# EAGLE design m219-bluetooth-input (EAGLE 7.6.0)
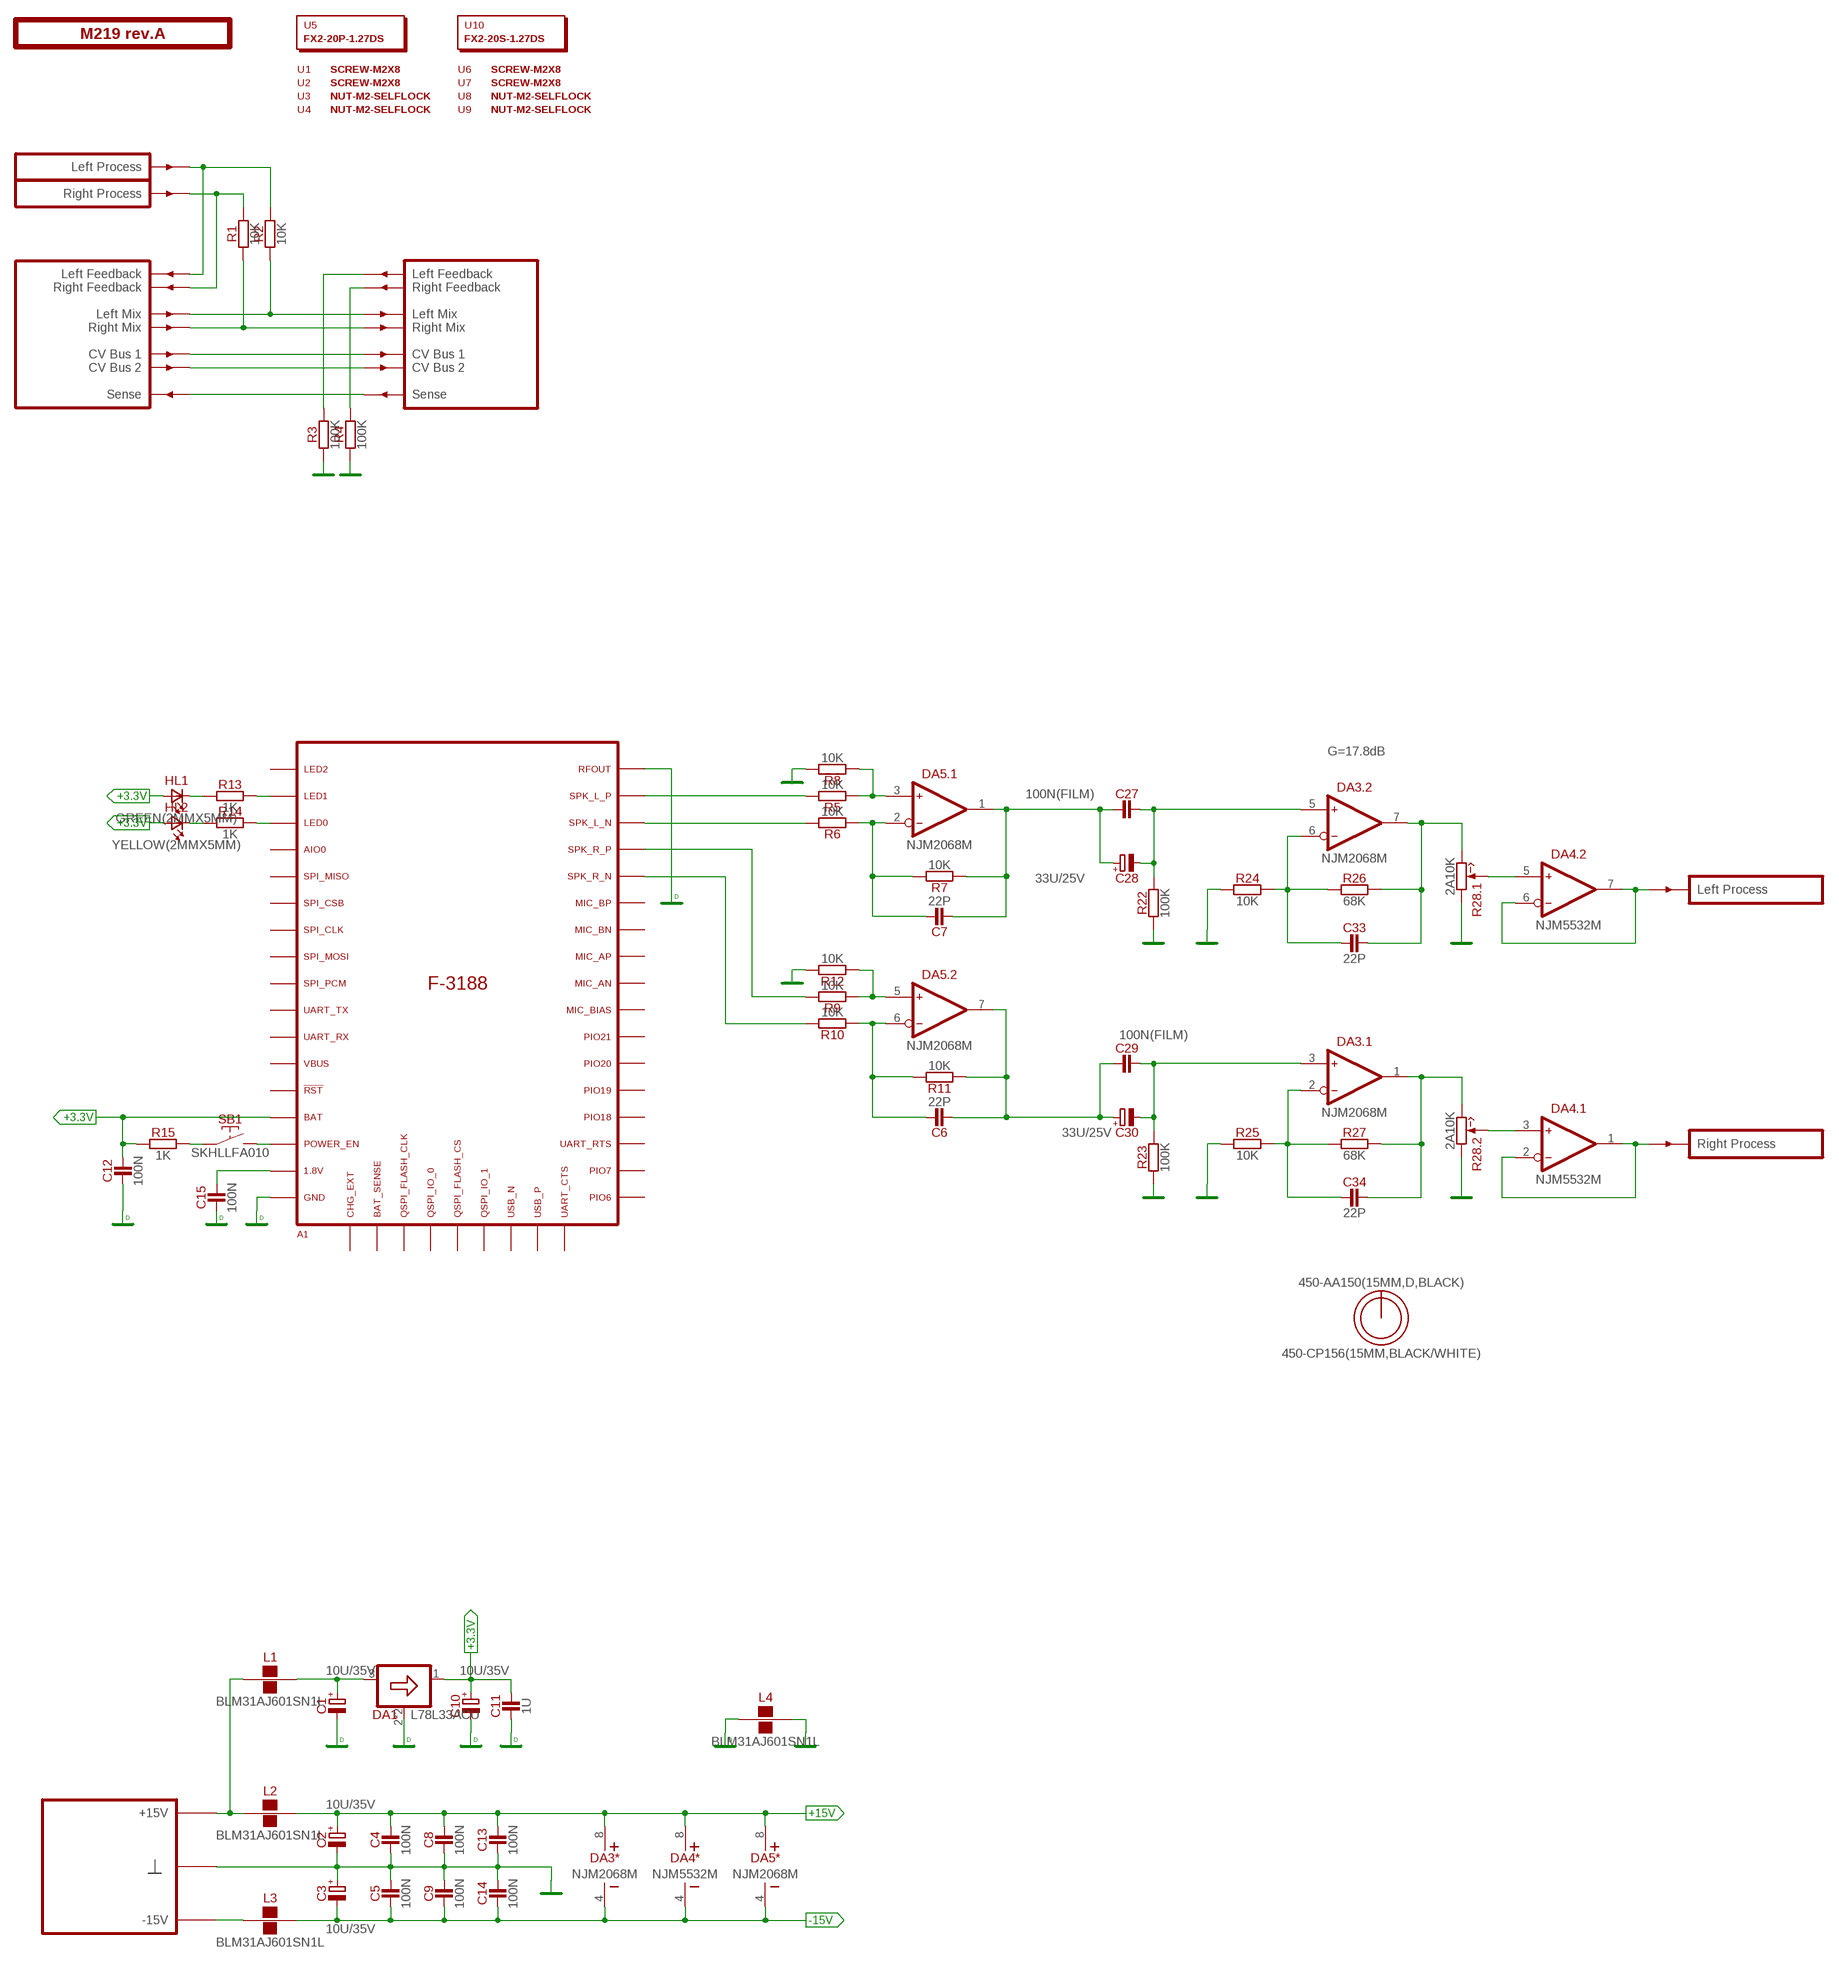
[diagram p0: schematic, sheet 1]

## Parts
A1  F3188  [F3188]
C1  10U/35V  [E2-5]
C2  10U/35V  [E2-5]
C3  10U/35V  [E2-5]
C4  100N  [C-0805]
C5  100N  [C-0805]
C6  22P  [C-0805]
C7  22P  [C-0805]
C8  100N  [C-0805]
C9  100N  [C-0805]
C10  10U/35V  [E2-5]
C11  1U  [C-0805]
C12  100N  [C-0805]
C13  100N  [C-0805]
C14  100N  [C-0805]
C15  100N  [C-0805]
C27  100N(FILM)  [C050-025X075]
C28  33U/25V  [E2,5-7]
C29  100N(FILM)  [C050-025X075]
C30  33U/25V  [E2,5-7]
C33  22P  [C-0805]
C34  22P  [C-0805]
DA1  L78L33ACU  [SOT89]
DA3  NJM2068M  [SO-8]
DA4  NJM5532M  [SO-8]
DA5  NJM2068M  [SO-8]
HL1  GREEN(2MMX5MM)  [LED2X5]
HL2  YELLOW(2MMX5MM)  [LED2X5]
L1  BLM31AJ601SN1L  [1206]
L2  BLM31AJ601SN1L  [1206]
L3  BLM31AJ601SN1L  [1206]
L4  BLM31AJ601SN1L  [1206]
O1  450-AA150(15MM,D,BLACK)  [EMPTY]
O2  450-CP156(15MM,BLACK/WHITE)  [EMPTY]
PCB1  M219 rev.A  ST2-BOARD-50  [ST2-BOARD-50]
R1  10K  [R-0805]
R2  10K  [R-0805]
R3  100K  [R-0805]
R4  100K  [R-0805]
R5  10K  [R-0805]
R6  10K  [R-0805]
R7  10K  [R-0805]
R8  10K  [R-0805]
R9  10K  [R-0805]
R10  10K  [R-0805]
R11  10K  [R-0805]
R12  10K  [R-0805]
R13  1K  [R-0805]
R14  1K  [R-0805]
R15  1K  [R-0805]
R22  100K  [R-0805]
R23  100K  [R-0805]
R24  10K  [R-0805]
R25  10K  [R-0805]
R26  68K  [R-0805]
R27  68K  [R-0805]
R28  2A10K  [RV11-DUAL]
SB1  SKHLLFA010  [SKHLLFA010]
U1  SCREW-M2X8  [EMPTY]
U2  SCREW-M2X8  [EMPTY]
U3  NUT-M2-SELFLOCK  [EMPTY]
U4  NUT-M2-SELFLOCK  [EMPTY]
U5  FX2-20P-1.27DS  [EMPTY]
U6  SCREW-M2X8  [EMPTY]
U7  SCREW-M2X8  [EMPTY]
U8  NUT-M2-SELFLOCK  [EMPTY]
U9  NUT-M2-SELFLOCK  [EMPTY]
U10  FX2-20S-1.27DS  [EMPTY]

## Nets
+3.3V: A1.P$14(BAT) C10.+ C11.2 C12.2 DA1.1(OUT) HL1.A HL2.A R15.1
+15V: C2.+ C4.2 C8.2 C13.2 DA3.8(*:V+) DA4.8(*:V+) DA5.8(*:V+) L2.2
-15V: C3.- C5.1 C9.1 C14.1 DA3.4(*:V-) DA4.4(*:V-) DA5.4(*:V-) L3.2
DGND: A1.P$17(GND) A1.P$43(RFOUT) C1.- C10.- C11.1 C12.1 C15.1 DA1.2(GND) DA1.2@1(GND) L4.1
GND: C2.- C3.+ C4.1 C5.2 C8.1 C9.2 C13.1 C14.2 L4.2 PCB1.B4'(GND) PCB1.B4(GND) PCB1.B5'(GND) PCB1.B5(GND) PCB1.B6'(GND) PCB1.B6(GND) PCB1.B7'(GND) PCB1.B7(GND) PCB1.B8'(GND) PCB1.B8(GND) R3.1 R4.1 R8.1 R12.1 R22.1 R23.1 R24.1 R25.1 R28.1'(.2:CCW) R28.1(.1:CCW)
LMIX: PCB1.ALMIX'(LMIX') PCB1.ALMIX(LMIX) R2.1
N$1 [power]: L1.1 L2.1 PCB1.A+15'(P+15V) PCB1.A+15(P+15V) PCB1.B+15'(P+15V) PCB1.B+15(P+15V)
N$2: PCB1.ARFBK'(RFBK') R4.2
N$3: DA5.3(.1:IN+) R5.2 R8.2
N$4: PCB1.ALFBK'(LFBK') R3.2
N$5 [power]: L3.1 PCB1.A-15'(P-15V) PCB1.A-15(P-15V) PCB1.B-15'(P-15V) PCB1.B-15(P-15V)
N$6: A1.P$42(SPK_L_P1) R5.1
N$7: C7.2 C27.1 C28.+ DA5.1(.1:OUT) R7.2
N$8: A1.P$41(SPK_L_N1) R6.1
N$9: C29.2 C30.- DA3.3(.1:IN+) R23.2
N$10: C27.2 C28.- DA3.5(.2:IN+) R22.2
N$11: C34.2 DA3.1(.1:OUT) R27.2 R28.3'(.2:CW)
N$12: C33.2 DA3.7(.2:OUT) R26.2 R28.3(.1:CW)
N$13: C33.1 DA3.6(.2:IN-) R24.2 R26.1
N$14: C34.1 DA3.2(.1:IN-) R25.2 R27.1
N$15: C7.1 DA5.2(.1:IN-) R6.2 R7.1
N$16: PCB1.BSENSE'(SENSE') PCB1.BSENSE(SENSE)
N$18: DA4.6(.2:IN-) DA4.7(.2:OUT) PCB1.BOUTL'(OUTL)
N$19: HL1.K(C) R13.1
N$20: A1.P$40(SPK_R_P1) R9.1
N$21: DA4.1(.1:OUT) DA4.2(.1:IN-) PCB1.BOUTR'(OUTR)
N$22: A1.P$39(SPK_R_N1) R10.1
N$23: DA4.5(.2:IN+) R28.2(.1:W)
N$24: C6.1 DA5.6(.2:IN-) R10.2 R11.1
N$25: DA4.3(.1:IN+) R28.2'(.2:W)
N$26: DA5.5(.2:IN+) R9.2 R12.2
N$28: HL2.K(C) R14.1
N$29: C1.+ DA1.3(IN) L1.2
N$30: A1.P$2(LED1) R13.2
N$31: A1.P$3(LED0) R14.2
N$32: A1.P$16(VBUS_1.8V) C15.2
N$33: R15.2 SB1.1
N$34: A1.P$15(POWER_EN) SB1.2
N$36: C6.2 C29.1 C30.+ DA5.7(.2:OUT) R11.2
N$39: PCB1.ARFBK(RFBK) PCB1.BINR(INR) R1.2
N$40: PCB1.ALFBK(LFBK) PCB1.BINL(INL) R2.2
N$41: PCB1.ACV1'(CV1') PCB1.ACV1(CV1)
N$42: PCB1.ACV2'(CV2') PCB1.ACV2(CV2)
RMIX: PCB1.ARMIX'(RMIX') PCB1.ARMIX(RMIX) R1.1
Unconnected: A1.P$1(LED2) A1.P$4(AIO0) A1.P$5(SPI_MISO/PIO3) A1.P$6(SPI_CSB/PIO4) A1.P$7(SPI_CLK/PIO5) A1.P$8(SPI_MOSI/PIO2) A1.P$9(SPI_PCM) A1.P$10(UART_TX/PIO1) A1.P$11(UART_RX/PIO0) A1.P$13(RST#) A1.P$18(CHG_EXT) A1.P$19(BAT_SENSE) A1.P$20(PIO10/QSPI_FLASH_CLK) A1.P$21(PIO11/QSPI_IO_0) A1.P$22(PIO12/QSPI_FLASH_CS) A1.P$23(PIO13/QSPI_IO_1) A1.P$24(USB_N) A1.P$25(USB_P) A1.P$26(PIO9/UART_CTS) A1.P$27(PIO6) A1.P$28(PIO7) A1.P$29(PIO8/UART_RTS) A1.P$30(PIO18) A1.P$31(PIO19) A1.P$32(PIO20) A1.P$33(PIO21) A1.P$34(MIC_BIAS) A1.P$35(MIC_AN) A1.P$36(MIC_AP) A1.P$37(MIC_BN) A1.P$38(MIC_BP) PCB1.ASMBCLK'(SMBCLK) PCB1.ASMBCLK(SMBCLK) PCB1.ASMBDAT'(SMBDAT) PCB1.ASMBDAT(SMBDAT)

## Notes on the sheet
- G=17.8dB

## Power pins joined to a net without a drawn wire
VBUS: A1.P$12(VBUS)

## Library data of the parts
A1 = module-wireless:F3188
C1-C3 C10 = capacitors-electrolytic:?; MOUSER: 647-USW1V100MDD
C4 C5 C8 C9 C12-C15 = capacitors:?; MOUSER: 77-VJ0805V104MXBPBC
C6 C7 C33 C34 = capacitors:?; MOUSER: 77-VJ0805A220GXACBC
C11 = capacitors:?; MOUSER: 77-VJ0805V105ZXXTBC
C27 C29 = capacitors:?; MOUSER: 505-MKS2.1/63/5
C28 C30 = capacitors-electrolytic:?
DA1 = regulators-linear:?; MOUSER: 511-L78L33ACU
DA3 DA5 = ic-jrc:NJM2068; MOUSER: 513-NJM2068M
DA4 = ic-jrc:NJM5532; MOUSER: 513-NJM5532M
HL1 HL2 = optoelectronics:?(2MMX5MM)
L1-L4 = inductors:BLM31AJ601SN1L; MOUSER: 81-BLM31AJ601SN1L
O1 = hardware:450-AA?; MOUSER: 450-AA150
O2 = hardware:450-C?; MOUSER: 450-CP156
PCB1 = module-footprints:ST2-BOARD-?
R1 R2 R5-R12 R24 R25 = resistors:?; MOUSER: 660-RK73H2ATTD1002F
R3 R4 R22 R23 = resistors:?; MOUSER: 660-RK73H2ATTD1003F
R13-R15 = resistors:?; MOUSER: 660-RK73H2ATTD1001F
R26 R27 = resistors:?; MOUSER: 660-RK73H2ATTD6802F
R28 = potentiometers:2**?; MOUSER: 688-RK12L12C0A0E
SB1 = switches:SKHLLFA010; MOUSER: 688-SKHLLF
U1-U4 U6-U9 = hardware:*?
U5 = hardware:?; MOUSER: 798-FX2-20P-1.27DS71
U10 = hardware:?; MOUSER: 798-FX2-20S-1.27DS71

## Board
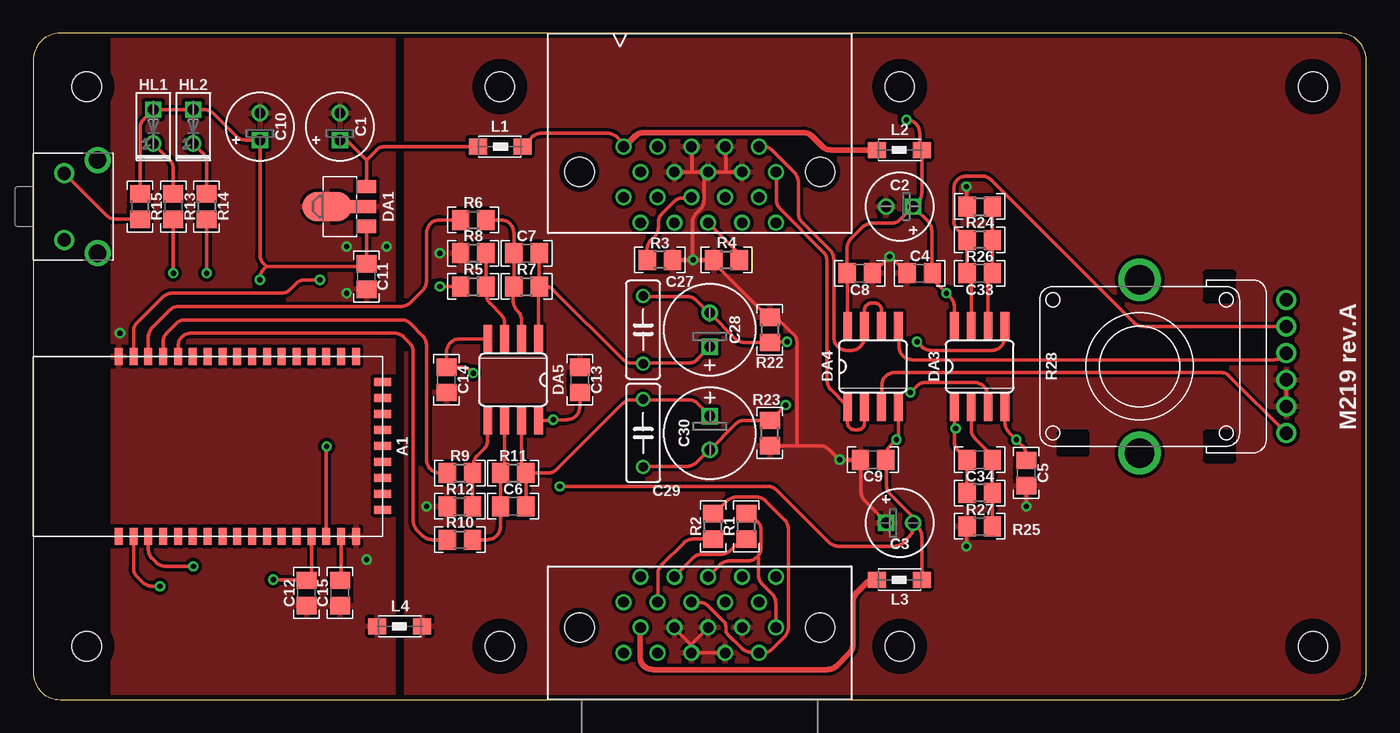
[diagram p1: board, top side]
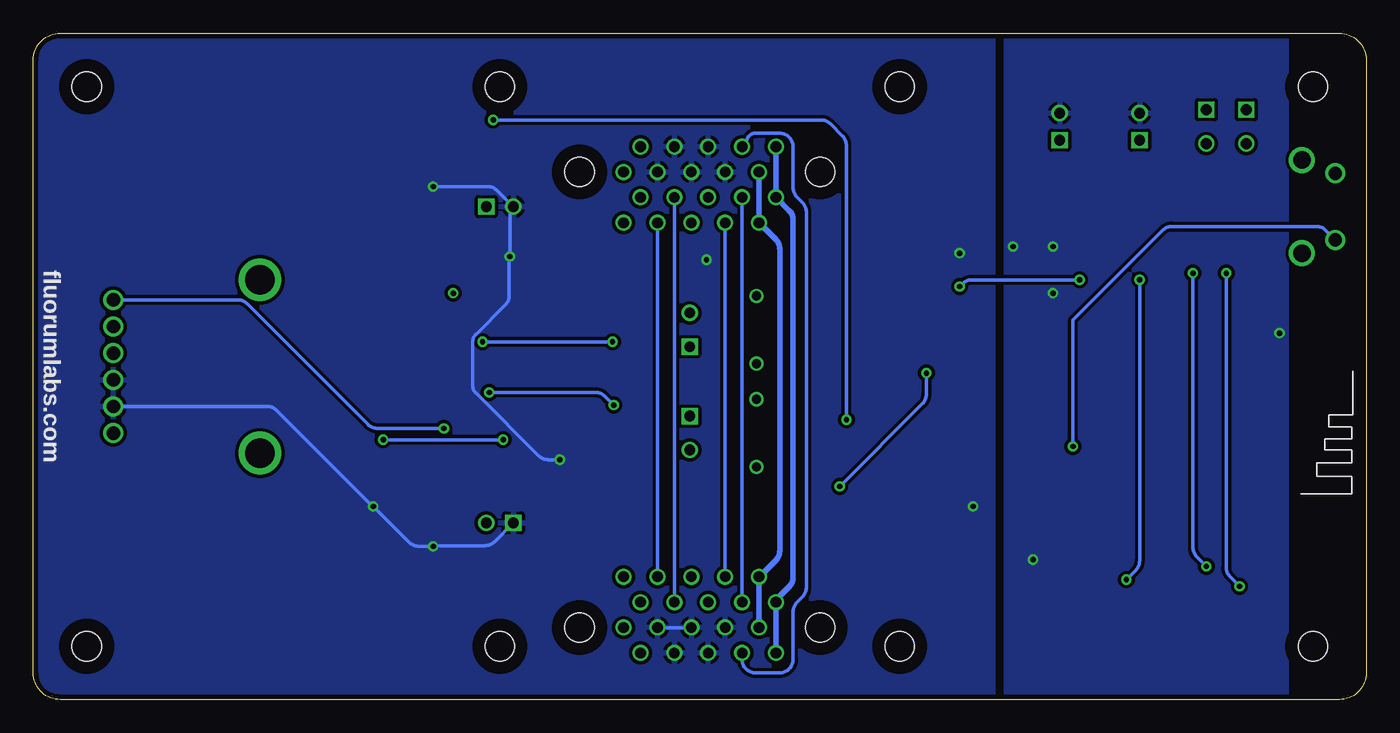
[diagram p2: board, bottom side, seen from below]

Size 100 x 50 mm. Coordinates in mm from the lower left corner, seen from the top.
Outline: 0,48 0,2 arc90 2,0 98,0 arc90 100,2 100,48 arc90 98,50 2,50 arc90 0,48
Copper layers (1*16): Top 0.0356mm / dielectric 1.5011mm / Bottom 0.0356mm
Design rules "sonictrain": minimum track width 6mil, minimum drill 13mil, track to track 8mil, track to pad 8mil, pad to pad 6mil, via to via 6mil, smd to smd 6mil, copper to edge 15mil, drill to drill 6mil, minimum pad ring 7mil, minimum via ring 7mil, stop-mask expansion 3mil, vias tented up to drill 25mil, thermal gap 10mil

### Footprints (pad centres in the part's own frame; a part is rotated, then mirrored left to right if it is on the bottom)
F3188 = smd 1.27 x 0.6: P$1 -6.75,-6.4; P$2 -6.75,-7.513; P$3 -6.75,-8.625; P$4 -6.75,-9.738; P$5 -6.75,-10.85; P$6 -6.75,-11.963; P$7 -6.75,-13.075; P$8 -6.75,-14.188; P$9 -6.75,-15.3; P$10 -6.75,-16.413; P$11 -6.75,-17.525; P$12 -6.75,-18.637; P$13 -6.75,-19.75; P$14 -6.75,-20.863; P$15 -6.75,-21.975; P$16 -6.75,-23.087; P$17 -6.75,-24.2; P$27 6.75,-24.2; P$28 6.75,-23.087; P$29 6.75,-21.975; P$30 6.75,-20.863; P$31 6.75,-19.75; P$32 6.75,-18.637; P$33 6.75,-17.525; P$34 6.75,-16.413; P$35 6.75,-15.3; P$36 6.75,-14.188; P$37 6.75,-13.075; P$38 6.75,-11.963; P$39 6.75,-10.85; P$40 6.75,-9.738; P$41 6.75,-8.625; P$42 6.75,-7.513; P$43 6.75,-6.4 | smd 0.6 x 1.27: P$18 -4.75,-26.2; P$19 -3.55,-26.2; P$20 -2.35,-26.2; P$21 -1.15,-26.2; P$22 0.05,-26.2; P$23 1.25,-26.2; P$24 2.45,-26.2; P$25 3.65,-26.2; P$26 4.85,-26.2
E2-5 = drill 0.813 square: + -1.016,0 | drill 0.813: - 1.016,0
C-0805 = smd 1.3 x 1.5: 1 -0.95,0; 2 0.95,0
C050-025X075 = drill 0.7: 1 -2.54,0; 2 2.54,0
E2,5-7 = drill 0.813 square: + -1.27,0 | drill 0.813: - 1.27,0
SOT89 = smd 1 x 1.5: 1 -1.499,-1.981; 3 1.499,-1.981 | smd 1 x 2: 2 0,-1.727 | smd 2.2 x 3.7: 2@1 0,0.94
SO-8 = smd 0.66 x 2.032: 1 -1.905,-3.073; 2 -0.635,-3.073; 3 0.635,-3.073; 4 1.905,-3.073; 5 1.905,3.073; 6 0.635,3.073; 7 -0.635,3.073; 8 -1.905,3.073
LED2X5 = drill 0.813 square: A -1.27,0 | drill 0.813: K 1.27,0
1206 = smd 1.35 x 1.2: 1 -1.7,0; 2 1.65,0
ST2-BOARD-50 = drill 0.8: A+15 44.285,7.31; A+15' 44.285,37.69; A-15 45.555,9.215; A-15' 45.555,35.785; ACV1 51.905,7.31; ACV1' 51.905,37.69; ACV2 53.175,9.215; ACV2' 53.175,35.785; ALFBK 49.365,7.31; ALFBK' 49.365,37.69; ALMIX 46.825,7.31; ALMIX' 46.825,37.69; ARFBK 50.635,9.215; ARFBK' 50.635,35.785; ARMIX 48.095,9.215; ARMIX' 48.095,35.785; ASMBCLK 55.715,9.215; ASMBCLK' 55.715,35.785; ASMBDAT 54.445,7.31; ASMBDAT' 54.445,37.69; B4 48.095,5.405; B4' 48.095,39.595; B5 49.365,3.5; B5' 49.365,41.5; B6 50.635,5.405; B6' 50.635,39.595; B7 51.905,3.5; B7' 51.905,41.5; B8 53.175,5.405; B8' 53.175,39.595; B+15 44.285,3.5; B+15' 44.285,41.5; B-15 45.555,5.405; B-15' 45.555,39.595; BINL 54.445,3.5; BINR 55.715,5.405; BOUTL' 54.445,41.5; BOUTR' 55.715,39.595; BSENSE 46.825,3.5; BSENSE' 46.825,41.5 | hole 2.2: 4,4; 4,46; 96,4; 96,46; 35,46; 65,46; 65,4; 35,4; 59.025,5.405; 40.975,5.405; 40.975,39.595; 59.025,39.595
R-0805 = smd 1.3 x 1.5: 1 -0.95,0; 2 0.95,0
RV11-DUAL = drill 1: 1 -1,-11; 1' -3,-11; 2 1,-11; 2' -5,-11; 3 3,-11; 3' 5,-11 | drill 2.2: S1 -6.5,0; S2 6.5,0
SKHLLFA010 = drill 1: 1 -2.5,2.32; 2 2.5,2.32 | drill 1.3: S1 -3.5,4.82; S2 3.5,4.82

### Placement (x,y rotation side)
A1  0,19 90 top
C1  23,43 90 top
C2  65,37 180 top
C3  65,13.25 0 top
C4  66.5,32 0 top
C5  74.5,17 270 top
C6  36,14.5 0 top
C7  37,33.5 0 top
C8  62,32 180 top
C9  63,18 180 top
C10  17,43 90 top
C11  25,31.75 90 top
C12  20.5,8 90 top
C13  41,24 270 top
C14  31,24 270 top
C15  23,8 90 top
C27  45.75,27.75 90 top
C28  50.75,27.75 90 top
C29  45.75,20 270 top
C30  50.75,20 270 top
C33  71,32 180 top
C34  71,18 180 top
DA1  23,37 90 top
DA3  71,25 0 top
DA4  63,25 0 top
DA5  36,24 180 top
HL1  9,43 270 top
HL2  12,43 270 top
L1  35,41.5 180 top
L2  65,41.25 0 top
L3  65,9 0 top
L4  27.5,5.5 0 top
O1  84,-100 0 top  (outside the outline)
O2  87,-100 0 top  (outside the outline)
PCB1  0,0 0 top
R1  53.5,13 90 top
R2  51,13 90 top
R3  47,33 180 top
R4  52,33 0 top
R5  33,31 0 top
R6  33,36 0 top
R7  37,31 0 top
R8  33,33.5 0 top
R9  32,17 0 top
R10  32,12 0 top
R11  36,17 0 top
R12  32,14.5 0 top
R13  10.5,37 270 top
R14  13,37 270 top
R15  8,37 270 top
R22  55.25,27.75 270 top
R23  55.25,20 90 top
R24  71,37 0 top
R25  71,13 0 top
R26  71,34.5 180 top
R27  71,15.5 180 top
R28  2*A10K  [RV11-DUAL]  83,25 90 top
SB1  0,37 270 top
U1  -8,-104.25 0 top  (outside the outline)
U2  -9,-105.5 0 top  (outside the outline)
U3  -12,-109.25 0 top  (outside the outline)
U4  -13,-110.5 0 top  (outside the outline)
U5  96,-100 0 top  (outside the outline)
U6  -10,-106.75 0 top  (outside the outline)
U7  -11,-108 0 top  (outside the outline)
U8  -14,-111.75 0 top  (outside the outline)
U9  -15,-113 0 top  (outside the outline)
U10  2,-103 0 top  (outside the outline)

### Tracks (layer width: path | path; a pad name or v marks a point on that pad's centre or on a via)
+3.3V  (via drill 0.4)
  Top 0.254: DA1.1 25,35.48 C11.2 24.8,32.5 17.5,32.5 | 17.5,32.5 17.29,32.71 arc-45 17,33.41 C10.+ 16.98,42 15.91,42 arc-45 15.21,42.29 13.52,43.98 arc45 12.82,44.27 HL2.A HL1.A 8.29,43.56 arc45 8,42.86 R15.1 | A1.P$14 20.86,9.31 C12.2 20.45,9 v18,9 | 17.5,32.5 17.29,32.29 arc45 17,31.59 v17,31.5
  Bottom 0.254: v17,31.5 17,10.41 arc45 17.29,9.71 v18,9
+15V  (via drill 0.4)
  Top 0.254: DA3.8 69.09,29.49 arc45 68.8,30.2 v68.5,30.5 67.45,31.55 C4.2 67.4,32.1 67.4,35.19 arc45 67.11,35.89 66.1,36.9 C2.+ | C2.+ 66.05,37 66.36,37.31 arc45 66.65,38.01 L2.2 66.5,41.4 66.5,42.5 arc90 v65.5,43.5 | DA4.8 61.09,31.95 C8.2 61.05,33.89 arc-45 61.34,34.59 62.21,35.46 arc-45 62.91,35.75 64.35,35.75 arc45 65.06,36.04 C2.+ | DA5.8 38.93,20.93 v39,21 40,21 arc90 41,22 C13.2
  Bottom 0.254: v39,21 39,41.59 arc-45 39.29,42.29 40.21,43.21 arc-45 40.91,43.5 v65.5,43.5
-15V  (via drill 0.4)
  Top 0.254: DA4.4 64.91,19.87 arc-45 v64.75,19.5 64.24,18.99 arc45 63.95,18.29 C9.1 64,17.9 64,16.11 arc45 64.29,15.41 65.95,13.75 65.95,13.35 C3.- | DA3.4 72.91,20.76 arc45 73.2,20.05 v73.75,19.5 74.21,19.04 arc-45 74.5,18.34 C5.1 | L3.2 66.65,12.24 arc45 66.36,12.94 66.05,13.25 C3.- | DA5.4 32,27.07 arc90 31,26.07 C14.1 32.14,24.95 arc-45 32.84,24.66 v33,24.5 | v39.5,16 55.09,16 arc-45 55.79,15.71 59.71,11.79 arc45 60.41,11.5 64.59,11.5 arc45 65.29,11.79 65.71,12.21 arc45 66,12.91 66,13.23 C3.-
  Bottom 0.254: v64.75,19.5 v73.75,19.5 | v33,24.5 33,22.91 arc45 33.29,22.21 v39.5,16
DGND  (via drill 0.4)
  other vias: 25,10.5 23.5,30.5 23.5,34 6.5,27.5 26.5,34
  pour Bottom (isolate 0.254, rank 2): 27,50 27,0 6,0 6,50
  pour Top (isolate 0.254, rank 2): 27,50 27,0 6,0 6,50
GND  (via drill 0.4)
  Top 0.254: R28.1 R28.1' | v70,11.5 70,12.95 R25.1 | C5.2 v74.5,14.5 | 49.4,39.6 50.6,39.6 PCB1.B6' | 49.4,39.6 PCB1.B4' | 51.95,39.6 50.75,39.6 PCB1.B6' | 51.95,39.6 53.15,39.6 PCB1.B8' | 49.4,39.6 49.4,41.5 PCB1.B5' | 51.95,39.6 51.95,41.5 PCB1.B7' | R3.1 v49.5,33 | v49.5,33 R4.1 51.05,32.75 55.1,28.7 R22.1 55.35,28.65 55.8,28.65 57.01,27.44 arc-45 57.3,26.74 57.3,19.05 | PCB1.B6' 50.3,39.5 50.3,37.46 arc-45 50.01,36.76 49.74,36.49 arc45 49.45,35.79 49.45,33.1 v49.5,33 | 49.35,4.1 49.35,3.5 PCB1.B5 PCB1.B7 | 49.35,4.1 48.15,5.3 PCB1.B4 | PCB1.B6 50.6,5.4 49.4,4.2 49.35,4.1 | C8.1 63,32 v64.25,33.25 64.35,33.2 C4.1 | v70,38.5 70,37.05 R24.1 | 57.3,19.05 58.99,19.05 arc-45 59.69,18.76 60.4,18.05 v60.5,18 C9.2 62.1,17.9 62.1,15.61 arc45 62.39,14.91 63.95,13.35 63.95,13.25 C3.+ | 57.3,19.05 R23.1
  Bottom 0.254: R28.1' 82.46,22 arc45 81.76,21.71 74.6,14.55 v74.5,14.5 71.79,11.79 arc-45 71.09,11.5 v70,11.5 69.9,11.55 66.11,11.55 arc-45 65.41,11.84 64,13.25 C3.+ | PCB1.B8 53.15,5.4 50.65,5.4 PCB1.B6 | v70,38.5 65.91,38.5 arc45 65.21,38.21 64,37 C2.- 64.05,36.9 64.25,36.7 v64.25,33.25 64.3,33.15 64.3,30.31 arc45 64.59,29.61 66.76,27.44 arc-45 67.05,26.74 67.05,23.66 arc-45 66.76,22.96 62.09,18.29 arc-45 61.39,18 v60.5,18
  other vias: 29.5,14.5 30.5,33.5
  pour Bottom (isolate 0.254): 98,0 28,0 28,50 98,50 arc-90 100,48 100,2 arc-90
  pour Top (isolate 0.254): 98,0 28,0 28,50 98,50 arc-90 100,48 100,2 arc-90
LMIX
  Top 0.254: R2.1 49.51,12.05 arc45 48.81,11.76 47.14,10.09 arc45 46.85,9.39 46.85,7.35 PCB1.ALMIX
  Bottom 0.254: PCB1.ALMIX' PCB1.ALMIX
N$1
  Top 0.254: PCB1.B+15' 44.28,41.72 43.79,42.21 arc45 43.09,42.5 38.11,42.5 arc45 37.41,42.21 L1.1
  Top 0.406: L2.1 59.86,41.25 arc-45 59.16,41.54 58.44,42.26 arc45 57.74,42.55 45.81,42.55 arc45 45.11,42.26 44.45,41.6 PCB1.B+15'
  Bottom 0.406: PCB1.B+15 PCB1.A+15 44.28,7.46 43.29,8.46 arc-45 43,9.16 43,35.99 arc-45 43.29,36.7 PCB1.A+15' PCB1.B+15'
N$2
  Top 0.254: R4.2 52.95,33.45 50.65,35.75 PCB1.ARFBK'
N$3
  Top 0.254: DA5.3 35.37,28.22 arc45 35.07,28.93 34.29,29.71 arc-45 34,30.41 34,30.95 R5.2 R8.2
N$4
  Top 0.254: R3.2 46.05,33.79 arc-45 46.34,34.49 46.61,34.76 arc45 46.9,35.46 46.9,35.79 arc-45 47.19,36.49 48.06,37.36 arc-45 48.76,37.65 49.35,37.65 PCB1.ALFBK'
N$5
  Top 0.406: L3.1 63.16,9 arc45 62.46,8.71 61.79,8.04 arc45 61.5,7.34 61.5,4.16 arc-45 61.21,3.46 60.29,2.54 arc-45 59.59,2.25 46.5,2.25 arc-90 45.5,3.25 45.5,5.35 PCB1.B-15
  Bottom 0.406: PCB1.B-15 PCB1.A-15 45.53,9.21 44.29,10.46 arc-45 44,11.16 44,33.82 arc-45 44.29,34.52 PCB1.A-15' PCB1.B-15'
N$6  (via drill 0.4)
  Top 0.254: A1.P$42 7.51,27.6 arc-45 7.8,28.3 9.71,30.21 arc-45 10.41,30.5 18.59,30.5 arc45 19.29,30.79 19.71,31.21 arc-45 20.41,31.5 v21.5,31.5 | v30.5,31 R5.1
  Bottom 0.254: v21.5,31.5 29.59,31.5 arc-45 30.29,31.21 v30.5,31
N$7
  Top 0.254: 45.75,25.25 49.14,25.25 arc45 49.84,25.54 50.75,26.45 C28.+ | 45.75,25.25 C27.1 | DA5.1 37.91,30.95 R7.2 | R7.2 C7.2 | 45.75,25.25 44.91,25.25 arc-45 44.21,25.54 39.04,30.71 arc45 38.34,31 R7.2
N$8
  Top 0.254: A1.P$41 8.62,27.21 arc-45 8.92,27.92 10.21,29.21 arc-45 10.91,29.5 27.59,29.5 arc45 28.29,29.79 29.21,30.71 arc45 29.5,31.41 29.5,35 arc-90 30.5,36 R6.1
N$9  (via drill 0.4)
  Top 0.254: v65.8,23.05 66.26,23.51 arc-45 66.96,23.8 70.6,23.8 arc-90 71.6,22.8 71.6,21.95 DA3.3 | v56.45,22.1 55.35,21 R23.2 53.36,20.95 arc45 52.66,20.66 50.75,18.75 C30.- 50.65,18.7 49.74,17.79 arc-45 49.04,17.5 45.75,17.5 C29.2
  Bottom 0.254: v56.45,22.1 57.11,22.76 arc-45 57.81,23.05 v65.8,23.05
N$10  (via drill 0.4)
  Top 0.254: v66.3,26.85 66.66,26.49 arc45 67.36,26.2 71.9,26.2 arc90 72.9,27.2 72.9,28.05 DA3.5 | v56.55,26.85 55.35,26.85 R22.2 53.36,26.8 arc-45 52.66,27.09 50.75,29 C28.- 50.65,29.05 49.74,29.96 arc45 49.04,30.25 45.75,30.25 C27.2
  Bottom 0.254: v56.55,26.85 v66.3,26.85
N$11  (via drill 0.4)
  Top 0.254: R27.2 C34.2 69.39,18.66 arc-45 69.09,19.37 69.09,20.35 | DA3.1 69.09,20.35 | v69.2,20.35 69.09,20.35
  Bottom 0.254: R28.3' 84.66,30 arc45 83.96,29.71 74.89,20.64 arc-45 74.19,20.35 v69.2,20.35
N$12
  Top 0.254: DA3.7 70.36,31.68 C33.2 R26.2 70,34.6 69.34,35.26 arc-45 69.05,35.96 69.05,38.3 arc-90 70.05,39.3 71.14,39.3 arc-45 71.84,39.01 82.56,28.29 arc45 83.26,28 R28.3
N$13
  Top 0.254: DA3.6 71.64,31.68 C33.1 R26.1 R24.2
N$14
  Top 0.254: DA3.2 70.36,20.3 arc45 70.66,19.59 71.95,18.3 C34.1 R27.1 R25.2
N$15
  Top 0.254: DA5.2 36.63,28.45 arc45 36.34,29.16 36.29,29.21 arc-45 36,29.91 36,30.95 R7.1 C7.1 36.05,35 arc90 35.05,36 R6.2
N$16
  Bottom 0.254: PCB1.BSENSE 46.83,3 arc-90 45.83,2 44,2 arc-90 43,3 43,6.59 arc45 42.71,7.29 42.29,7.71 arc-45 42,8.41 42,36.59 arc-45 42.29,37.29 42.71,37.71 arc45 43,38.41 43,41.5 arc-90 44,42.5 45.83,42.5 arc-90 46.5,41.83 PCB1.BSENSE'
N$18
  Top 0.254: DA4.6 63.63,29.25 arc90 63.13,29.75 62.87,29.75 arc90 62.37,29.25 DA4.7 62.35,27.95 62.35,27.2 arc-90 61.35,26.2 61.05,26.2 arc-90 60.05,27.2 60.05,33.04 arc45 59.76,33.74 57.69,35.81 arc-45 57.4,36.51 57.4,38.84 arc45 57.11,39.54 55.44,41.21 arc45 54.74,41.5 PCB1.BOUTL'
N$19
  Top 0.254: R13.1 10.5,39.82 arc45 10.21,40.52 HL1.K
N$20
  Top 0.254: A1.P$40 9.74,26.82 arc-45 10.03,27.53 10.71,28.21 arc-45 11.41,28.5 27.59,28.5 arc-45 28.29,28.21 29.21,27.29 arc-45 29.5,26.59 29.5,18 arc90 30.5,17 R9.1
N$21
  Top 0.254: DA4.2 62.37,20.75 arc-90 61.87,20.25 61.59,20.25 arc-90 61.09,20.75 DA4.1 61.05,22.05 59.84,23.26 arc-45 59.55,23.96 59.55,32.89 arc45 59.26,33.59 56.04,36.81 arc-45 55.75,37.51 55.75,39.55 PCB1.BOUTR'
N$22
  Top 0.254: A1.P$39 10.85,26.5 arc-90 11.85,27.5 27.09,27.5 arc-45 27.79,27.21 28.21,26.79 arc-45 28.5,26.09 28.5,13.41 arc45 28.79,12.71 29.21,12.29 arc45 29.91,12 R10.1
N$23
  Top 0.254: R28.2 93.79,25.79 arc-45 93.09,25.5 65.95,25.5 arc-90 64.95,26.5 64.95,28.05 DA4.5
N$24
  Top 0.254: DA5.6 35.37,17.32 R11.1 C6.1 35.05,13 arc-90 34.05,12 R10.2
N$25
  Top 0.254: R28.2' 89.74,24.26 arc45 89.04,24.55 64.65,24.55 arc90 63.65,23.55 63.65,21.95 DA4.3
N$26
  Top 0.254: DA5.5 34.09,19.51 arc-45 33.8,18.8 33.29,18.29 arc45 33,17.59 33,17.05 R9.2 R12.2
N$28
  Top 0.254: R14.1 13,40.32 arc45 12.71,41.02 HL2.K
N$29
  Top 0.254: L1.2 26.41,41.5 arc45 25.71,41.21 25,40.5 | 25,40.5 25,38.52 DA1.3 | C1.+ 23.1,41.98 arc-45 23.81,41.69 25,40.5
N$30  (via drill 0.4)
  Top 0.254: R13.2 v10.5,32 | v9.5,8.5 8.91,8.5 arc-45 8.21,8.79 7.8,9.2 arc-45 7.51,9.9 A1.P$2
  Bottom 0.254: v10.5,32 10.5,9.91 arc-45 10.21,9.21 v9.5,8.5
N$31  (via drill 0.4)
  Top 0.254: R14.2 v13,32 | A1.P$3 8.62,11.29 arc45 8.92,10.58 9.21,10.29 arc45 9.91,10 v12,10
  Bottom 0.254: v13,32 13,11.41 arc-45 12.71,10.71 v12,10
N$32
  Top 0.254: A1.P$16 23.09,9.04 C15.2
N$33
  Top 0.254: R15.2 6.18,36.05 arc-45 5.48,36.34 SB1.1
N$34  (via drill 0.4)
  Top 0.254: A1.P$15 21.98,18.98 v22,19
  Bottom 0.254: v22,19 22,28.5 15.29,35.21 arc45 14.59,35.5 3.73,35.5 arc45 3.03,35.21 SB1.2
N$36
  Top 0.254: 45.75,22.5 49.14,22.5 arc-45 49.84,22.21 50.75,21.3 C30.+ | 45.75,22.5 C29.1 | DA5.7 36.63,17.32 R11.2 | R11.2 C6.2 | 45.75,22.5 44.91,22.5 arc45 44.21,22.21 39.29,17.29 arc-45 38.59,17 R11.2
N$39
  Top 0.254: R1.2 53.75,13.95 54.31,13.39 arc-45 54.6,12.69 54.6,11.39 arc-45 54.33,10.72 | 54.33,10.72 54.29,10.69 arc-45 53.59,10.4 52.21,10.4 arc45 51.51,10.11 50.65,9.25 PCB1.ARFBK | 54.33,10.72 54.4,10.65 54.4,9.36 arc45 54.69,8.66 55.41,7.94 arc-45 55.7,7.24 55.7,5.45 PCB1.BINR
N$40
  Top 0.254: R2.2 51.1,13.95 52.06,14.91 arc-45 52.76,15.2 54.24,15.2 arc-45 54.94,14.91 56.36,13.49 arc-45 56.65,12.79 56.65,5.41 arc-45 56.36,4.71 55.44,3.79 arc-45 54.74,3.5 PCB1.BINL 54.35,3.55 53.86,3.55 arc-45 53.16,3.84 52.1,4.9 arc-45 51.95,5.26 51.95,5.49 arc45 51.8,5.85 50.64,7.01 arc45 49.94,7.3 49.4,7.3 PCB1.ALFBK
N$41
  Bottom 0.254: PCB1.ACV1 PCB1.ACV1'
N$42
  Bottom 0.254: PCB1.ACV2' PCB1.ACV2
RMIX
  Top 0.254: R1.1 53.15,12.05 52.29,11.19 arc-45 51.59,10.9 50.16,10.9 arc45 49.46,10.61 48.1,9.25 PCB1.ARMIX
  Bottom 0.254: PCB1.ARMIX' PCB1.ARMIX